# EAGLE schematic headphone-detection-rev-a (EAGLE 7.3.0)
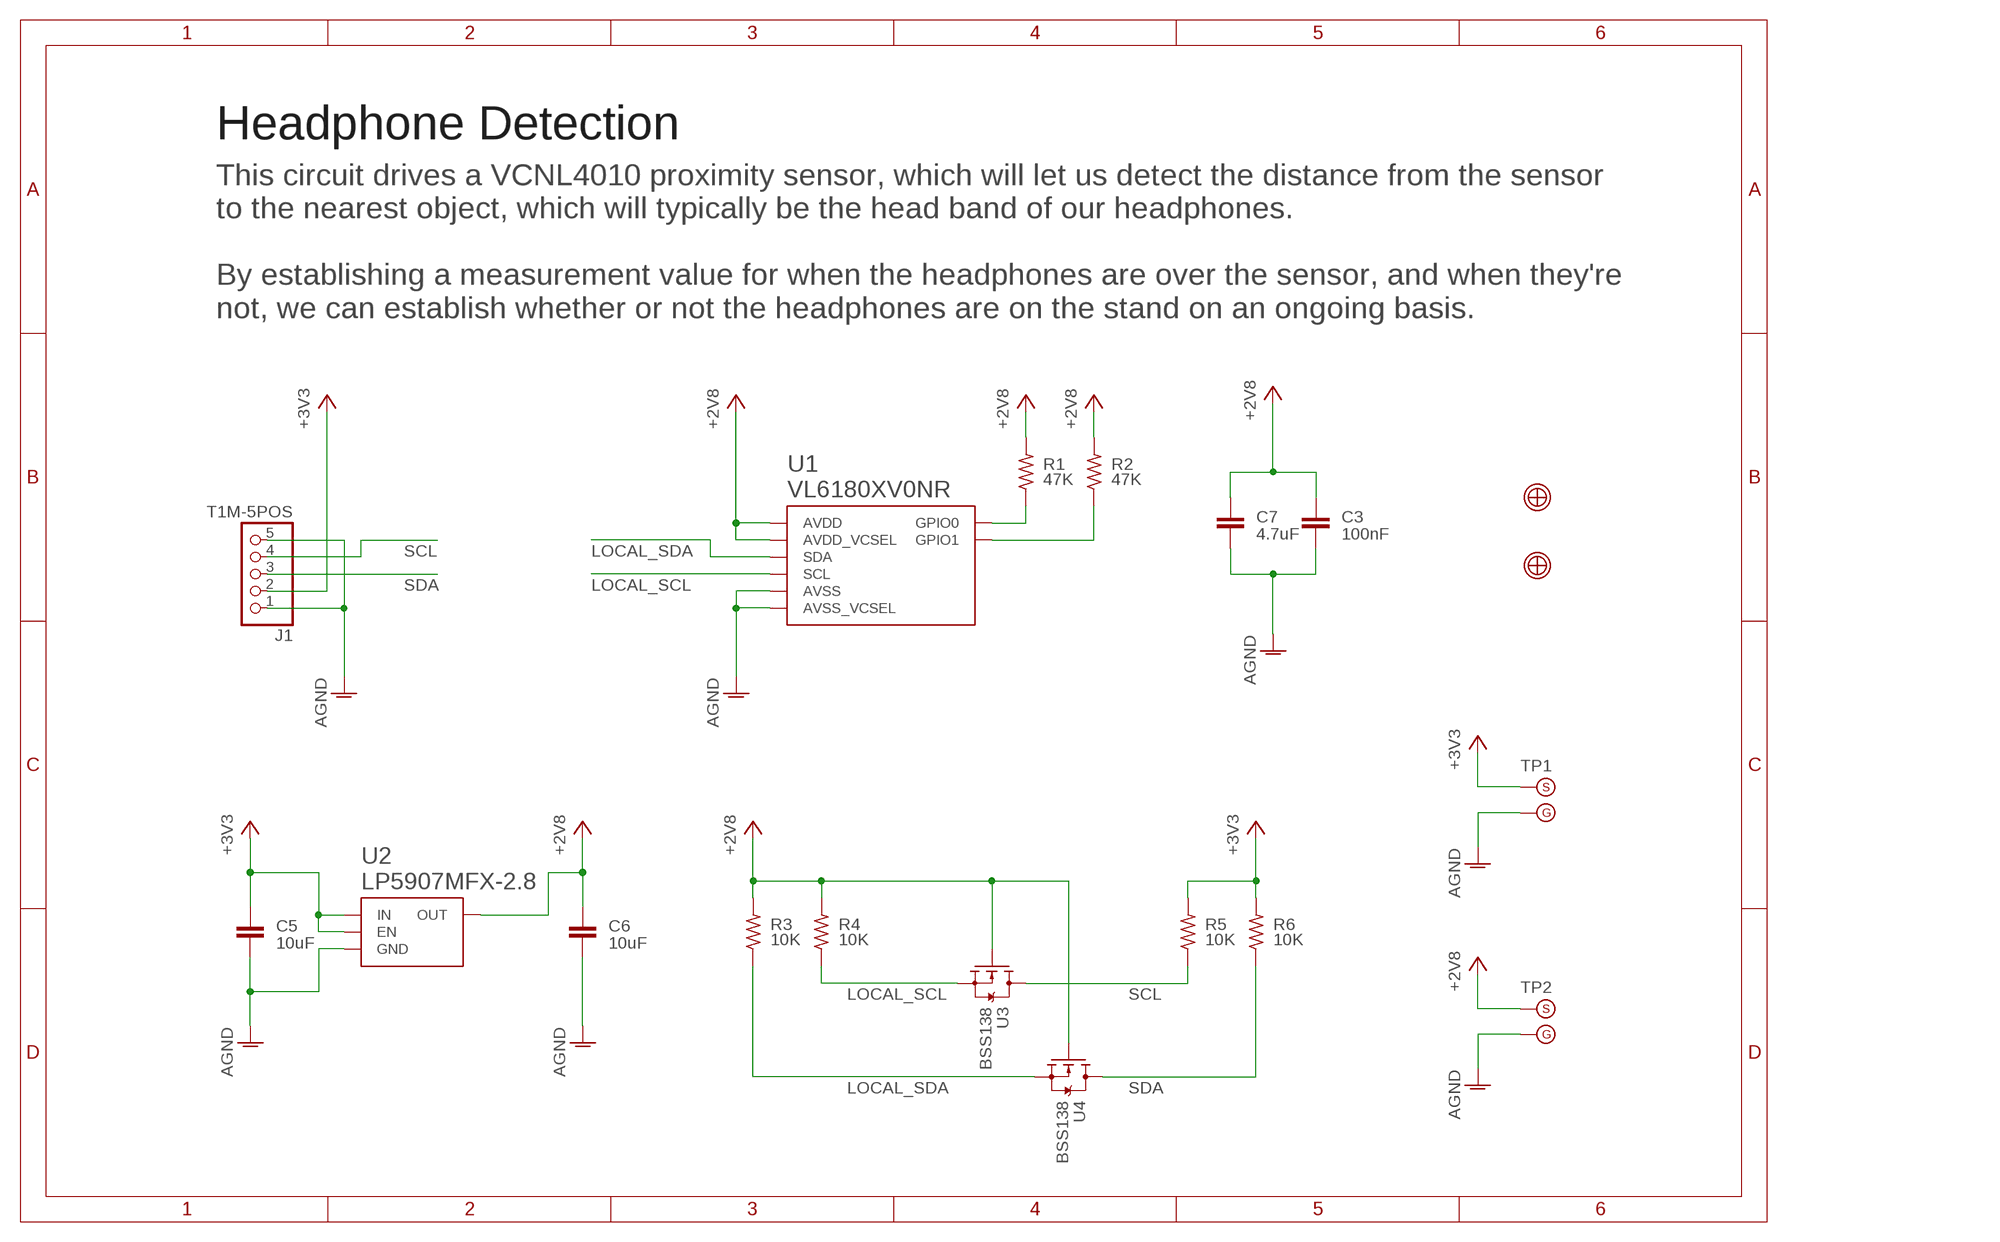
[diagram p0: schematic, sheet 1]
SHEET1 (A4L-NODOC): BOM: EXCLUDE

## Parts
C3  100nF  CAPACITOR-0402  [C0402]
C5  10uF  CAPACITOR-0603  [C0603]
C6  10uF  CAPACITOR-0603  [C0603]
C7  4.7uF  CAPACITOR-0402  [C0402]
J1  T1M-5POS  [T1M-SINGLE-5POS]
R1  47K  RESISTOR-0402  [R0402]
R2  47K  RESISTOR-0402  [R0402]
R3  10K  RESISTOR-0402  [R0402]
R4  10K  RESISTOR-0402  [R0402]
R5  10K  RESISTOR-0402  [R0402]
R6  10K  RESISTOR-0402  [R0402]
TP1  TESTPOINT-WITH-GND  [TESTPOINT-1.5-WITH-GND]
TP2  TESTPOINT-WITH-GND  [TESTPOINT-1.5-WITH-GND]
U1  VL6180XV0NR  [VL6180X]
U2  LP5907MFX-2.8  [R-PDSO-G5-DBV]
U3  BSS138  BSS138LT3G  [SOT23]
U4  BSS138  BSS138LT3G  [SOT23]
U$1  FIDUCIAL-1MM  [FIDUCIAL_1MM]
U$2  FIDUCIAL-1MM  [FIDUCIAL_1MM]

## Nets
+2V8: C3.1 C6.1 C7.1 R1.2 R2.2 R3.2 R4.2 TP2.S U1.8(AVDD_VCSEL) U1.10(AVDD) U2.5(OUT) U3.1(G) U4.1(G)
+3V3: C5.1 J1.2 R5.2 R6.2 TP1.S U2.1(IN) U2.3(EN)
AGND: C3.2 C5.2 C6.2 C7.2 J1.1 J1.5 TP1.G TP2.G U1.9(AVSS_VCSEL) U1.12(AVSS) U2.2(GND)
LOCAL_SCL: R4.1 U1.5(SCL) U3.2(S)
LOCAL_SDA: R3.1 U1.6(SDA) U4.2(S)
N$3: R2.1 U1.1(GPIO1)
N$5: R1.1 U1.4(GPIO0)
SCL: J1.4 R5.1 U3.3(D)
SDA: J1.3 R6.1 U4.3(D)

## Notes on the sheet
- Headphone Detection
- This circuit drives a VCNL4010 proximity sensor, which will let us detect the distance from the sensor
  to the nearest object, which will typically be the head band of our headphones.
  
  By establishing a measurement value for when the headphones are over the sensor, and when they're
  not, we can establish whether or not the headphones are on the stand on an ongoing basis.

## Library data of the parts
C3 = passives:CAPACITOR: Capacitor; PN: GRM155R61A105KE15D
C5 C6 = passives:CAPACITOR: Capacitor; PN: C1608X5R0J106M080AB
C7 = passives:CAPACITOR: Capacitor; PN: GRM155R60J475ME87D
J1 = samtec:T1M-5POS: T1M Series - Discrete Wire Headers (1.00 mm / 0.03937")
R1-R6 = passives:RESISTOR
TP1 TP2 = test:TESTPOINT-WITH-GND; BOM: EXCLUDE
U1 = st-microelectronics:VL6180X: Proximity and ambient light sensing (ALS) module
U2 = texas-instruments:LP5907: 250-mA Ultra-Low-Noise, Low-IQ LDO; PN: LP5907MFX-2.8/NOPB
U3 U4 = on-semiconductor:BSS138: MOSFET 50V 200mA N-Channel
U$1 U$2 = fiducials:FIDUCIAL: Fidicual Mark Used by pick-and-place machines to align and orient boards before loading components.; BOM: EXCLUDE